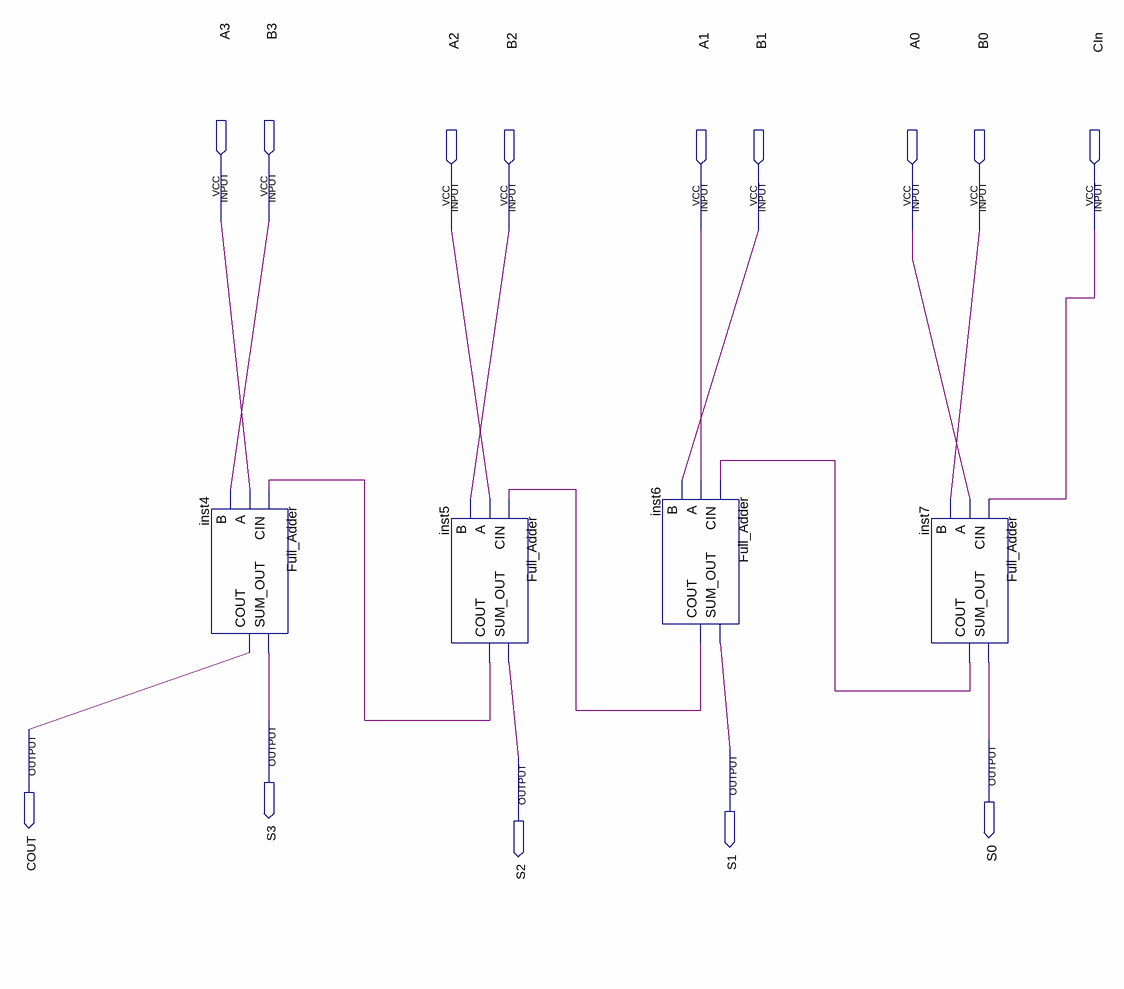
[diagram p0: schematic sheet]
// Quartus schematic FA_4.bdf as structural Verilog: 4 symbols, 14 pins
module FA_4 (
  input  A3,
  input  B3,
  input  A2,
  input  B2,
  input  A1,
  input  B1,
  input  A0,
  input  B0,
  input  CIn,
  output S3,
  output COUT,
  output S0,
  output S1,
  output S2
);

  wire inst5_cout, inst6_cout, inst7_cout;

  Full_Adder inst4 (.CIN(inst5_cout), .A(A3), .B(B3), .SUM_OUT(S3), .COUT(COUT));
  Full_Adder inst5 (.CIN(inst6_cout), .A(A2), .B(B2), .SUM_OUT(S2), .COUT(inst5_cout));
  Full_Adder inst6 (.CIN(inst7_cout), .A(A1), .B(B1), .SUM_OUT(S1), .COUT(inst6_cout));
  Full_Adder inst7 (.CIN(CIn), .A(A0), .B(B0), .SUM_OUT(S0), .COUT(inst7_cout));
endmodule
